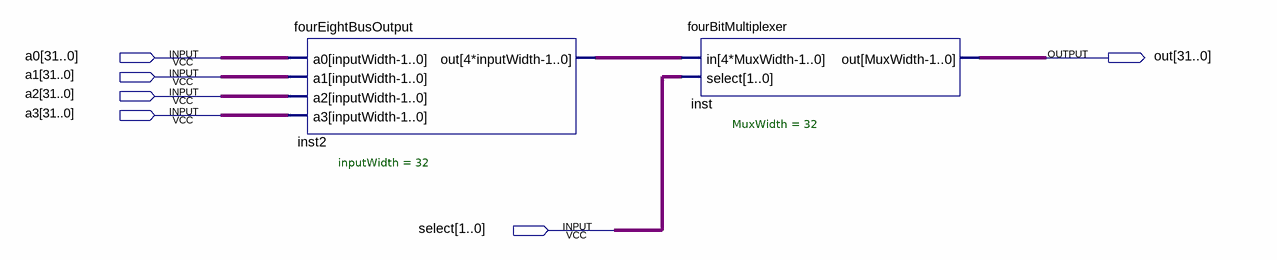
[diagram p0: schematic sheet]
// Quartus schematic ReadDeterminer.bdf as structural Verilog: 2 symbols, 6 pins
module ReadDeterminer (
  input  [31:0] a0,
  input  [31:0] a1,
  input  [31:0] a2,
  input  [31:0] a3,
  input  [1:0] select,
  output [31:0] out
);

  wire [127:0] inst2_out;

  fourEightBusOutput #(.inputWidth(32)) inst2 (.a0(a0), .a1(a1), .a2(a2), .a3(a3), .out(inst2_out));
  fourBitMultiplexer #(.MuxWidth(32)) inst (.in(inst2_out), .select(select), .out(out));
endmodule
